# Altium schematic sheet mainsheet.SchDoc
size A4; SheetNumber: 1; SheetTotal: 8
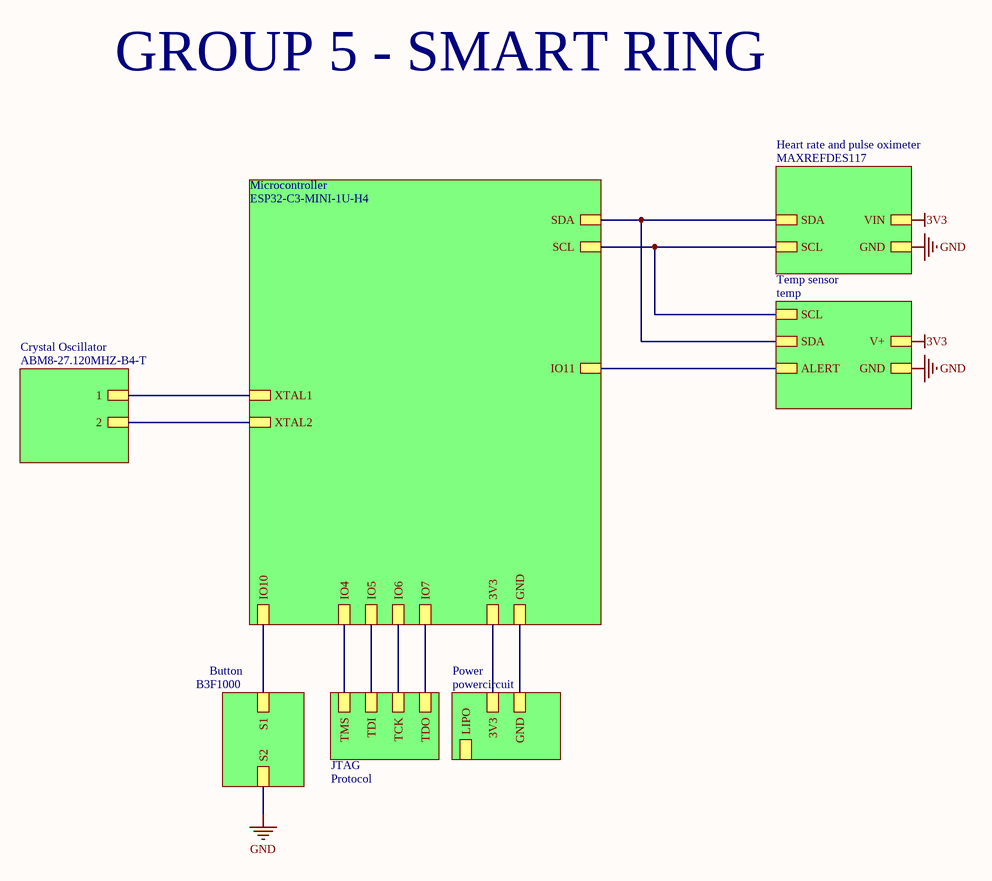
[diagram p0: mainsheet.SchDoc]

## Sub-sheets
Button = B3F1000: S1, S2
Crystal Oscillator = ABM8-27.120MHZ-B4-T: 1, 2
Heart rate and pulse oximeter = MAXREFDES117: SCL, SDA, GND, VIN
Microcontroller = ESP32-C3-MINI-1U-H4: GND, 3V3, IO10, IO4, IO5, IO6, IO7, SCL, SDA, XTAL1, XTAL2, IO11
Power = powercircuit: 3V3, GND, LIPO
Protocol = JTAG: TDO, TCK, TDI, TMS
Temp sensor = temp: SCL, GND, ALERT, V+, SDA

## Nets
3V3: sheet Heart rate and pulse oximeter/VIN, sheet Temp sensor/V+
GND: sheet Heart rate and pulse oximeter/GND, sheet Button/S2, sheet Temp sensor/GND
(unnamed): sheet Heart rate and pulse oximeter/SCL, sheet Temp sensor/SCL, sheet Microcontroller/SCL
(unnamed): sheet Heart rate and pulse oximeter/SDA, sheet Temp sensor/SDA, sheet Microcontroller/SDA
(unnamed): sheet Button/S1, sheet Microcontroller/IO10
(unnamed): sheet Temp sensor/ALERT, sheet Microcontroller/IO11
(unnamed): sheet Microcontroller/GND, sheet Power/GND
(unnamed): sheet Microcontroller/3V3, sheet Power/3V3
(unnamed): sheet Microcontroller/IO4, sheet Protocol/TMS
(unnamed): sheet Microcontroller/IO5, sheet Protocol/TDI
(unnamed): sheet Microcontroller/IO6, sheet Protocol/TCK
(unnamed): sheet Microcontroller/IO7, sheet Protocol/TDO
(unnamed): sheet Microcontroller/XTAL1, sheet Crystal Oscillator/1
(unnamed): sheet Microcontroller/XTAL2, sheet Crystal Oscillator/2

## Notes on the sheet
- GROUP 5 - SMART RING